# Altium schematic sheet hud_v300_PWR.SchDoc
size A4; SheetNumber: 2; SheetTotal: 6
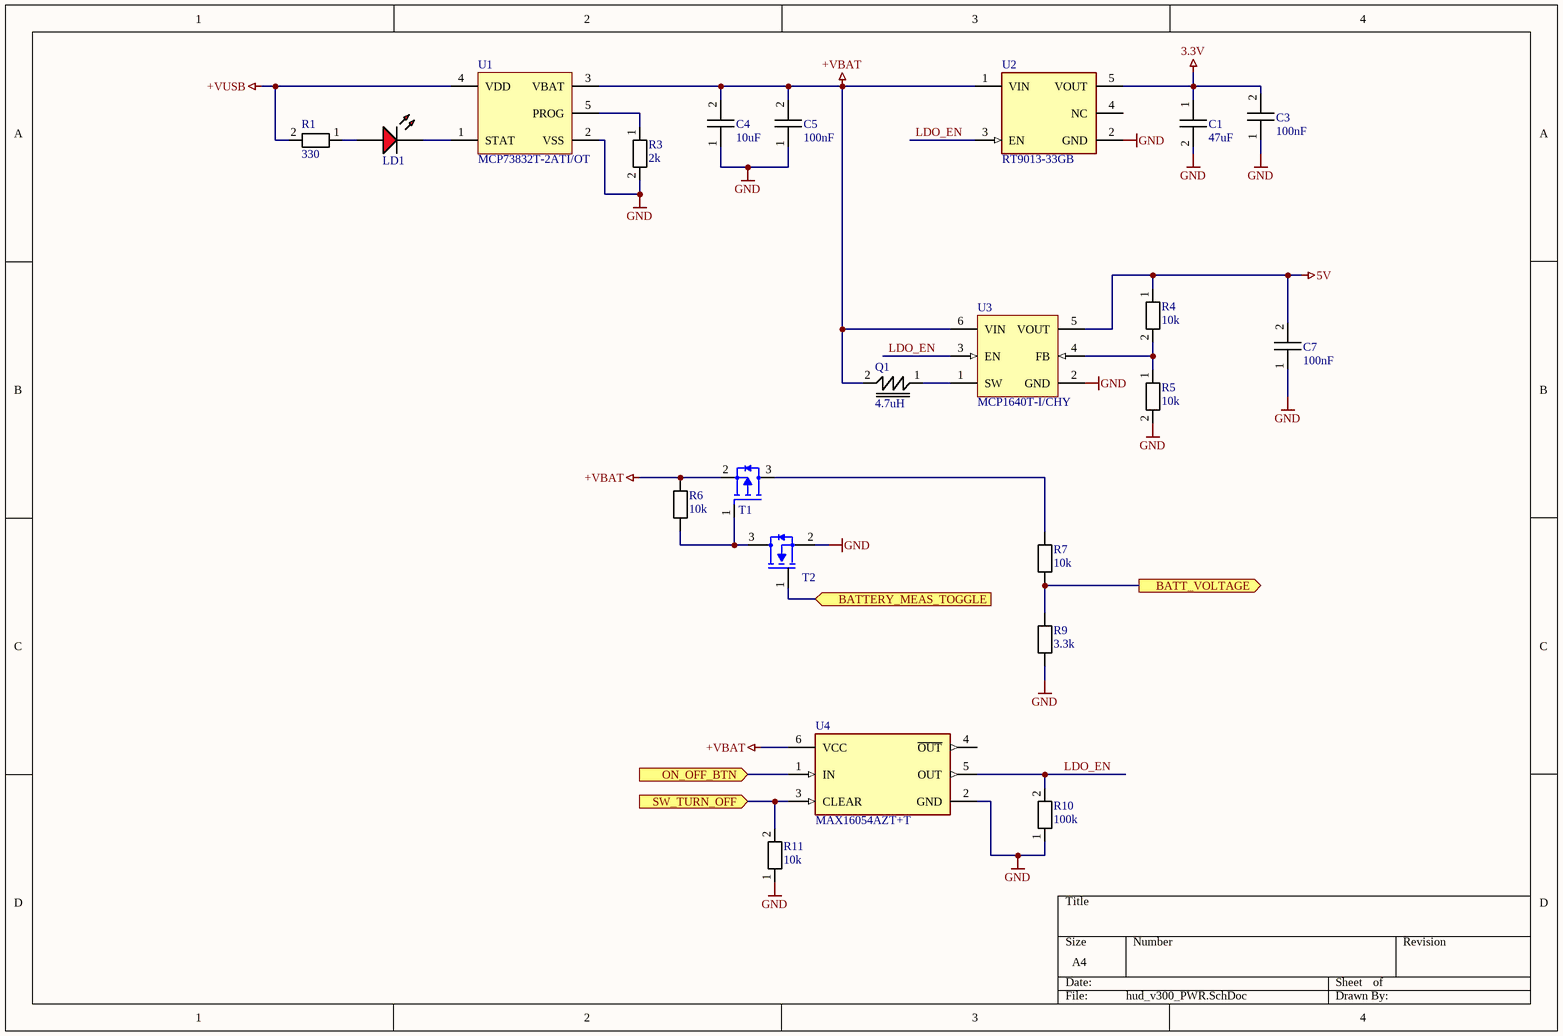
[diagram p0: hud_v300_PWR.SchDoc]

## Parts
C1  47uF  [0805_C]
C3  100nF  [0805_C]
C4  10uF  [1210_C]
C5  100nF  [0805_C]
C7  100nF  [0805_C]
LD1  LED_RED  [LED_SMD_90DEG_RED]  (value not drawn)
Q1  4.7uH  [1210]
R1  330  [0805]
R3  2k  [0805]
R4  10k  [0805]
R5  10k  [0805]
R6  10k  [0805]
R7  10k  [0805]
R9  3.3k  [0805]
R10  100k  [0805]
R11  10k  [0805]
T1  BSS84  [SOT23]  (value not drawn)
T2  MMBF170  [SOT23]  (value not drawn)
U1  MCP73832T-2ATI/OT  [SOT23-5]
U2  RT9013-33GB  [SOT23-5]
U3  MCP1640T-I/CHY  [SOT23-6]
U4  MAX16054AZT+T  [FP-Z6-1-IPC_A]

## Ports
BATT_VOLTAGE (out, see hud_v300_MAIN[2A], hud_v300_MCU[4C]), BATTERY_MEAS_TOGGLE (in, see hud_v300_MAIN[2B], hud_v300_MCU[4B]), ON_OFF_BTN (in, see hud_v300_MAIN[2A]), SW_TURN_OFF (in, see hud_v300_MAIN[2B], hud_v300_MCU[4B])

## Nets
3.3V: C1.1 C3.2 U2.5(VOUT)
5V: C7.2 R4.1 U3.5(VOUT)
+VBAT: C4.2 C5.2 Q1.2 R6.2 T1.2(S) U1.3(VBAT) U2.1(VIN) U3.6(VIN) U4.6(VCC)
+VUSB: R1.2 U1.4(VDD)
GND: C1.2 C3.1 C4.1 C5.1 C7.1 R3.2 R5.2 R9.1 R10.1 R11.1 T2.2(Source) U1.2(VSS) U2.2(GND) U3.2(GND) U4.2(GND)
BATT_VOLTAGE: R7.1 R9.2 ; port BATT_VOLTAGE
BATTERY_MEAS_TOGGLE: T2.1(Gate) ; port BATTERY_MEAS_TOGGLE
LDO_EN: R10.2 U2.3(EN) U3.3(EN) U4.5(OUT)
ON_OFF_BTN: U4.1(IN) ; port ON_OFF_BTN
SW_TURN_OFF: R11.2 U4.3(CLEAR) ; port SW_TURN_OFF
NetLD1_A: LD1.A R1.1
NetLD1_K: LD1.K U1.1(STAT)
NetQ1_1: Q1.1 U3.1(SW)
NetR3_1: R3.1 U1.5(PROG)
NetR4_2: R4.2 R5.1 U3.4(FB)
NetR6_1: R6.1 T1.1(G) T2.3(Drain)
NetR7_2: R7.2 T1.3(D)

Not connected (* = marked no-connect by the designer): U2 4(NC); U4 4(~{OUT})

## Library data of the parts
C1 C3-C5 C7 = CAPACITOR
LD1 = LED_RED: Type (0°): LTSTC170CKT; Type (90°): HSMS-C110
Q1 = COIL
R1 R3 R9 R10 = RESISTOR: Parameter 1: 10k
R4-R7 R11 = RESISTOR: Parameter 1: 10k
T1 = BSS84: P-Chanel MOSFET
T2 = MMBF170: N MOSFET
U1 = MCP73832T-2ATI/OT: Miniature Single-Cell, Fully Integrated Li-Ion, Li-Polymer Charge Management Controller, 4.2V, 5-Pin SOT-23, Industrial Temperature, Tape and Reel
U2 = RT9013-33GB: 500mA, Low Dropout, Low Noise Ultra-Fast Without / Bypass Capacitor CMOS LDO Regulator
U3 = MCP1640T-I/CHY: Start-up Synchronous Boost Regulator with True Output Disconnect or Input / Output Bypass Option, 350 mA, Input Voltage 0.65 to 5.5 V, Output Voltage 2.0 to 5.5 V, -40 to 85 degC, 6-pin SOT-23 (CHY6), Tape and Reel
U4 = CMP-0251-00627-2: IC INTFACE SPECIALIZED TSOT23-6; Undervoltage Threshold: 1.8V; Max Supply Voltage: 5.5V; Min Supply Voltage: 2.7V; Max Power Dissipation: 727W; Number of Voltages Monitored: 1; Watchdog Timer: No; Operating Supply Current: 7uA; Output Type: PUSH-PULL; RoHS Compliant: Yes; Series: -; Contact Plating: Tin; Length: 4mm; Height: 0.73mm; Radiation Hardening: No; Number of Pins: 6; Min Operating Temperature: -40°C; Width: 4mm; Mount: Surface Mount; Package Quantity: 1; Max Operating Temperature: 125°C; Packaging: Tape and Reel; Case/Package: SOT-23-6